# EAGLE schematic robot (EAGLE 7.7.0)
TITLE: 2-Wheel Robot
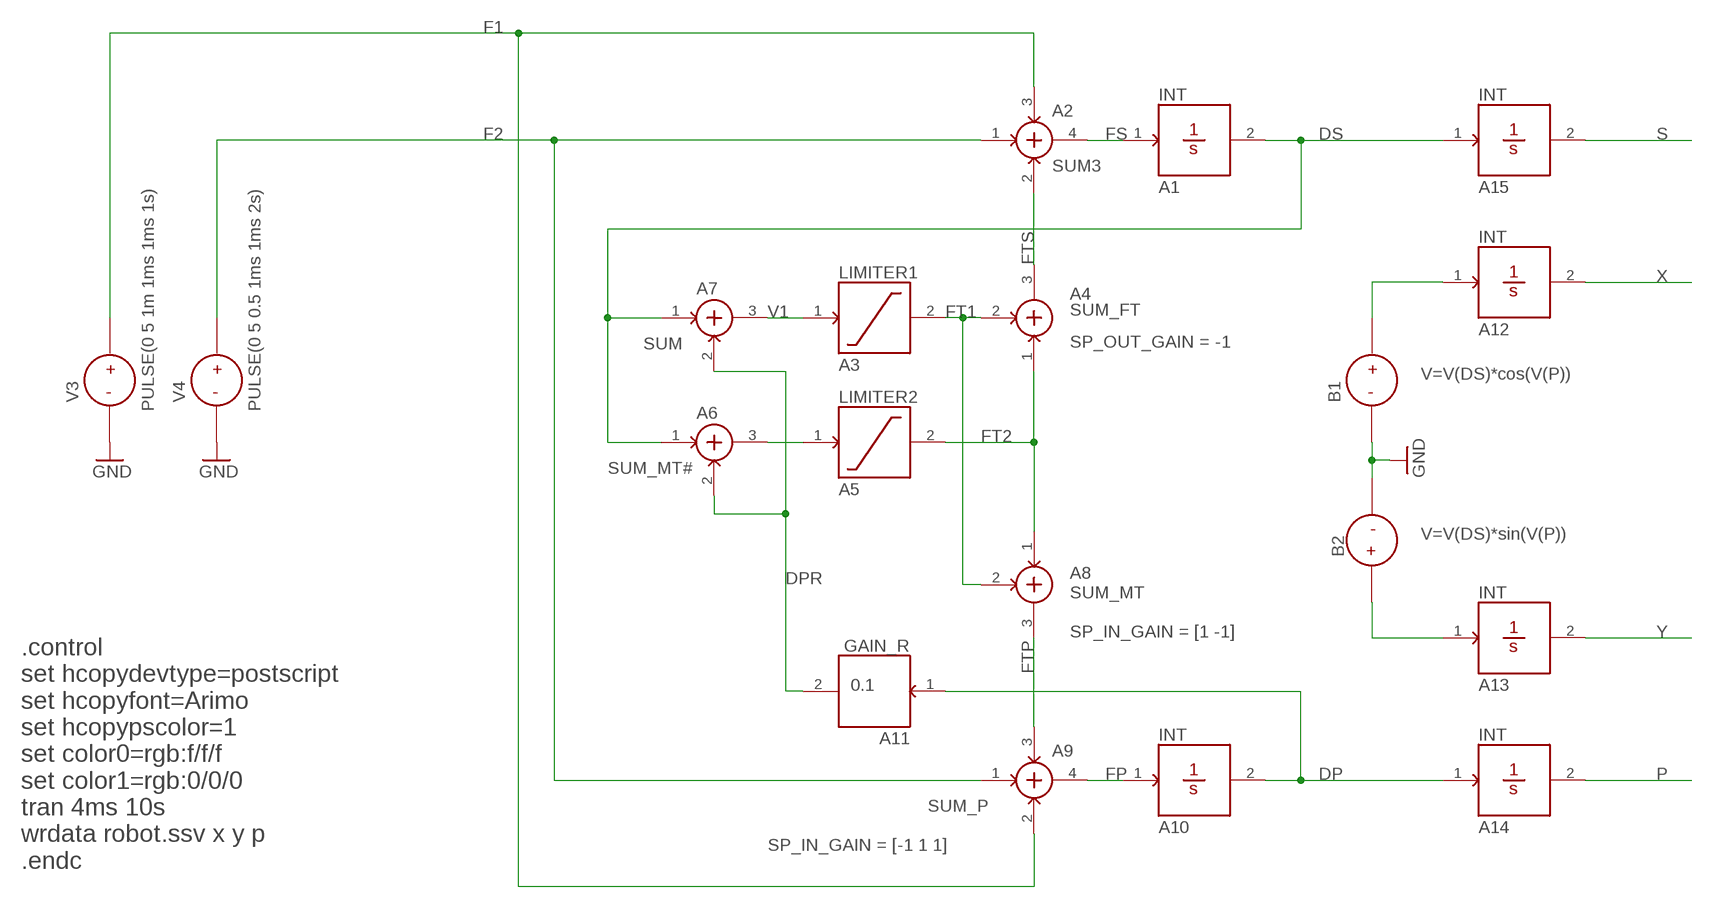
[diagram p0: schematic, sheet 1]

## Parts
A1  INT  [SPICE2]
A2  SUM3  [SPICE4]
A3  LIMITER1  LIMITER  [SPICE2]
A4  SUM_FT  SUM  [SPICE3]
A5  LIMITER2  LIMITER  [SPICE2]
A6  SUM_MT#  SUM  [SPICE3]
A7  SUM  [SPICE3]
A8  SUM_MT  SUM  [SPICE3]
A9  SUM_P  SUM3  [SPICE4]
A10  INT  [SPICE2]
A11  GAIN_R  GAIN  [SPICE2]
A12  INT  [SPICE2]
A13  INT  [SPICE2]
A14  INT  [SPICE2]
A15  INT  [SPICE2]
B1  V=V(DS)*cos(V(P))  VSOURCE  [VSOURCE]
B2  V=V(DS)*sin(V(P))  VSOURCE  [VSOURCE]
V3  PULSE(0 5 1m 1ms 1ms 1s)  VSOURCE  [VSOURCE]
V4  PULSE(0 5 0.5 1ms 1ms 2s)  VSOURCE  [VSOURCE]

## Nets
DP: A10.2(AOUT) A11.1(AIN) A14.1(AIN)
DPR: A6.2(AIN2) A7.2(AIN2) A11.2(AOUT)
DS: A1.2(AOUT) A6.1(AIN1) A7.1(AIN1) A15.1(AIN)
F1: A2.3(AIN3) A9.2(AIN2) V3.1
F2: A2.1(AIN1) A9.1(AIN1) V4.1
FP: A9.4(AOUT) A10.1(AIN)
FS: A1.1(AIN) A2.4(AOUT)
FT1: A3.2(AOUT) A4.2(AIN2) A8.2(AIN2)
FT2: A4.1(AIN1) A5.2(AOUT) A8.1(AIN1)
FTP: A8.3(AOUT) A9.3(AIN3)
FTS: A2.2(AIN2) A4.3(AOUT)
GND: B1.2 B2.2 V3.2 V4.2
N$2: A12.1(AIN) B1.1
N$3: A13.1(AIN) B2.1
P: A14.2(AOUT)
S: A15.2(AOUT)
V1: A3.1(AIN) A7.3(AOUT)
V2: A5.1(AIN) A6.3(AOUT)
X: A12.2(AOUT)
Y: A13.2(AOUT)

## Notes on the sheet
- .control
  set hcopydevtype=postscript
  set hcopyfont=Arimo
  set hcopypscolor=1
  set color0=rgb:f/f/f
  set color1=rgb:0/0/0
  tran 4ms 10s
  wrdata robot.ssv x y p
  .endc

## Library data of the parts
A1 A10 A12-A15 = ngspice:INT: The Integrator block is a simple integration stage that approximates the integral with respect to time of an input signal. The block also includes gain and input offset parameters to allow for tailoring of the required signal, and output upper and lower limits to prevent convergence errors resulting from excessively large output values. Note that these limits specify integrator behavior similar to that found in an operational amplifierbased integration stage, in that once a limit is reached, additional storage does not occur. Thus, the input of a negative value to an integrator which is currently driving at the out upper limit level will immediately cause a drop in the output, regardless of how long the integrator was previously summing positive inputs. The incremental value of output below the output upper limit and above the output lower limit at which smoothing begins is specified via the limit range parameter. In AC analysis, the value returned is equal to the gain divided by the radian frequency of analysis. Note that truncation error checking is included in the “int” block. This should provide for a more accurate simulation of the time integration function, since the model will inherently request smaller time increments between simulation points if truncation errors would otherwise be excessive.; SPICE_MODEL: .model >VALUE int(in_offset gain out_lower_limit out_upper_limit limit_range out_ic); SP_GAIN: 1; SP_IN_OFFSET: 0; SP_LIMIT_RANGE: 1e-6; SP_OUT_IC: 0; SP_OUT_LOWER_LIMIT: -1e12; SP_OUT_UPPER_LIMIT: 1e12
A2 = ngspice:SUM3: This function is a summer block with 2-to-N input ports. Individual gains and offsets can be applied to each input and to the output. Each input is added to its respective offset and then multiplied by its gain. The results are then summed, multiplied by the output gain and added to the output offset. This model will operate in DC, AC, and Transient analysis modes.; SPICE_MODEL: .model >VALUE summer(in_offset in_gain out_gain out_offset); SPICE_PORTS: [ 1 2 3 ] 4; SP_IN_GAIN: [1 1 1]; SP_IN_OFFSET: [0 0 0]; SP_OUT_GAIN: 1; SP_OUT_OFFSET: 0
A3 A5 = ngspice:LIMITER: The Limiter is a single input, single output function similar to the Gain Block. However, the output of the Limiter function is restricted to the range specified by the output lower and upper limits. This model will operate in DC, AC and Transient analysis modes. Note that the limit range is the value BELOW THE UPPER LIMIT AND ABOVE THE LOWER LIMIT at which smoothing of the output begins. For this model, then, the limit range represents the delta WITH RESPECT TO THE OUTPUT LEVEL at which smoothing occurs. Thus, for an input gain of 2.0 and output limits of 1.0 and -1.0 volts, the output will begin to smooth out at ±0.9 volts, which occurs when the input value is at ±0.4.; SPICE_MODEL: .model >VALUE limit(in_offset gain out_lower_limit out_upper_limit limit_range fraction); SP_FRACTION: false; SP_GAIN: 10; SP_IN_OFFSET: 0; SP_LIMIT_RANGE: 1e-6; SP_OUT_LOWER_LIMIT: -1; SP_OUT_UPPER_LIMIT: 1
A4 = ngspice:SUM: This function is a summer block with 2-to-N input ports. Individual gains and offsets can be applied to each input and to the output. Each input is added to its respective offset and then multiplied by its gain. The results are then summed, multiplied by the output gain and added to the output offset. This model will operate in DC, AC, and Transient analysis modes.; SPICE_MODEL: .model >VALUE summer(in_offset in_gain out_gain out_offset); SPICE_PORTS: [ 1 2 ] 3; SP_IN_GAIN: [1 1]; SP_IN_OFFSET: [0 0]; SP_OUT_GAIN: -1; SP_OUT_OFFSET: 0
A6 A7 = ngspice:SUM: This function is a summer block with 2-to-N input ports. Individual gains and offsets can be applied to each input and to the output. Each input is added to its respective offset and then multiplied by its gain. The results are then summed, multiplied by the output gain and added to the output offset. This model will operate in DC, AC, and Transient analysis modes.; SPICE_MODEL: .model >VALUE summer(in_offset in_gain out_gain out_offset); SPICE_PORTS: [ 1 2 ] 3; SP_IN_GAIN: [1 1]; SP_IN_OFFSET: [0 0]; SP_OUT_GAIN: 1; SP_OUT_OFFSET: 0
A8 = ngspice:SUM: This function is a summer block with 2-to-N input ports. Individual gains and offsets can be applied to each input and to the output. Each input is added to its respective offset and then multiplied by its gain. The results are then summed, multiplied by the output gain and added to the output offset. This model will operate in DC, AC, and Transient analysis modes.; SPICE_MODEL: .model >VALUE summer(in_offset in_gain out_gain out_offset); SPICE_PORTS: [ 1 2 ] 3; SP_IN_GAIN: [1 -1]; SP_IN_OFFSET: [0 0]; SP_OUT_GAIN: 1; SP_OUT_OFFSET: 0
A9 = ngspice:SUM3: This function is a summer block with 2-to-N input ports. Individual gains and offsets can be applied to each input and to the output. Each input is added to its respective offset and then multiplied by its gain. The results are then summed, multiplied by the output gain and added to the output offset. This model will operate in DC, AC, and Transient analysis modes.; SPICE_MODEL: .model >VALUE summer(in_offset in_gain out_gain out_offset); SPICE_PORTS: [ 1 2 3 ] 4; SP_IN_GAIN: [-1 1 1]; SP_IN_OFFSET: [0 0 0]; SP_OUT_GAIN: 1; SP_OUT_OFFSET: 0
A11 = ngspice:GAIN: This function is a simple gain block with optional offsets on the input and the output. The input offset is added to the input, the sum is then multiplied by the gain, and the result is produced by adding the output offset. This model will operate in DC, AC, and Transient analysis modes.; SPICE_MODEL: .model gain_r gain(in_offset gain_r out_offset); SP_GAIN: 0.1; SP_IN_OFFSET: 0; SP_OUT_OFFSET: 0
B1 B2 V3 V4 = ngspice:VSOURCE